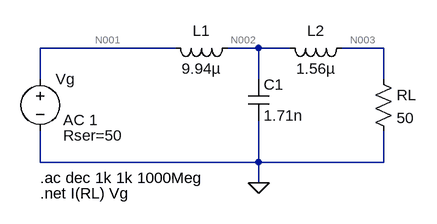
[diagram p0: schematic TS13_Albanesi_Punto5SimulacionCircuital.asc]
TS13_Albanesi_Punto5SimulacionCircuital.asc, the LTspice schematic file:
Version 4
SHEET 1 880 680
WIRE 192 80 -16 80
WIRE 320 80 272 80
WIRE 368 80 320 80
WIRE 512 80 448 80
WIRE -16 128 -16 80
WIRE 320 128 320 80
WIRE 512 128 512 80
WIRE -16 256 -16 208
WIRE 320 256 320 192
WIRE 320 256 -16 256
WIRE 512 256 512 208
WIRE 512 256 320 256
WIRE 320 288 320 256
FLAG 320 288 0
SYMBOL voltage -16 112 R0
WINDOW 123 35 79 Left 2
WINDOW 39 35 103 Left 2
SYMATTR Value2 AC 1
SYMATTR SpiceLine Rser=50
SYMATTR InstName Vg
SYMATTR Value ""
SYMBOL ind 288 64 R90
WINDOW 0 5 56 VBottom 2
WINDOW 3 32 56 VTop 2
SYMATTR InstName L1
SYMATTR Value 9.94µ
SYMBOL ind 464 64 R90
WINDOW 0 5 56 VBottom 2
WINDOW 3 32 56 VTop 2
SYMATTR InstName L2
SYMATTR Value 1.56µ
SYMBOL cap 304 128 R0
SYMATTR InstName C1
SYMATTR Value 1.71n
SYMBOL res 496 112 R0
SYMATTR InstName RL
SYMATTR Value 50
TEXT -16 280 Left 2 !.ac dec 1k 1k 1000Meg
TEXT -16 304 Left 2 !.net I(RL) Vg

The netlist it stands for:
* TS13_Albanesi_Punto5SimulacionCircuital.asc
Vg N001 0 AC 1 Rser=50
L1 N002 N001 9.94µ
L2 N003 N002 1.56µ
C1 N002 0 1.71n
RL N003 0 50
.ac dec 1k 1k 1000Meg
.net I(RL) Vg
.backanno
.end

* Results of the author's LTspice run, read from the files saved beside the schematic
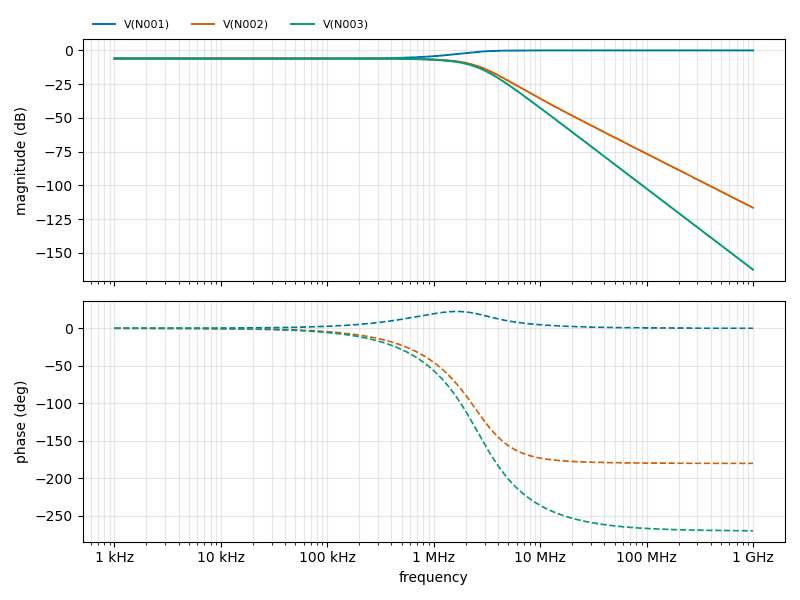
[diagram p1: AC Analysis of TS13_Albanesi_Punto5SimulacionCircuital.asc, plotted from the saved traces]
* AC Analysis, 1 run:
*   V(N001): -6.02 dB at 1 kHz, -0.00 dB at 1 GHz, peak -0.00 dB at 1 GHz, 3 dB below the peak at 1.5 MHz
*   V(N002): -6.02 dB at 1 kHz, -116.53 dB at 1 GHz, peak -6.02 dB at 1 kHz, 3 dB below the peak at 1.938 MHz
*   V(N003): -6.02 dB at 1 kHz, -162.38 dB at 1 GHz, peak -6.02 dB at 1 kHz, 3 dB below the peak at 1.783 MHz